# Altium schematic sheet header_conn.SchDoc
size A4; SheetNumber: 6; SheetTotal: 10
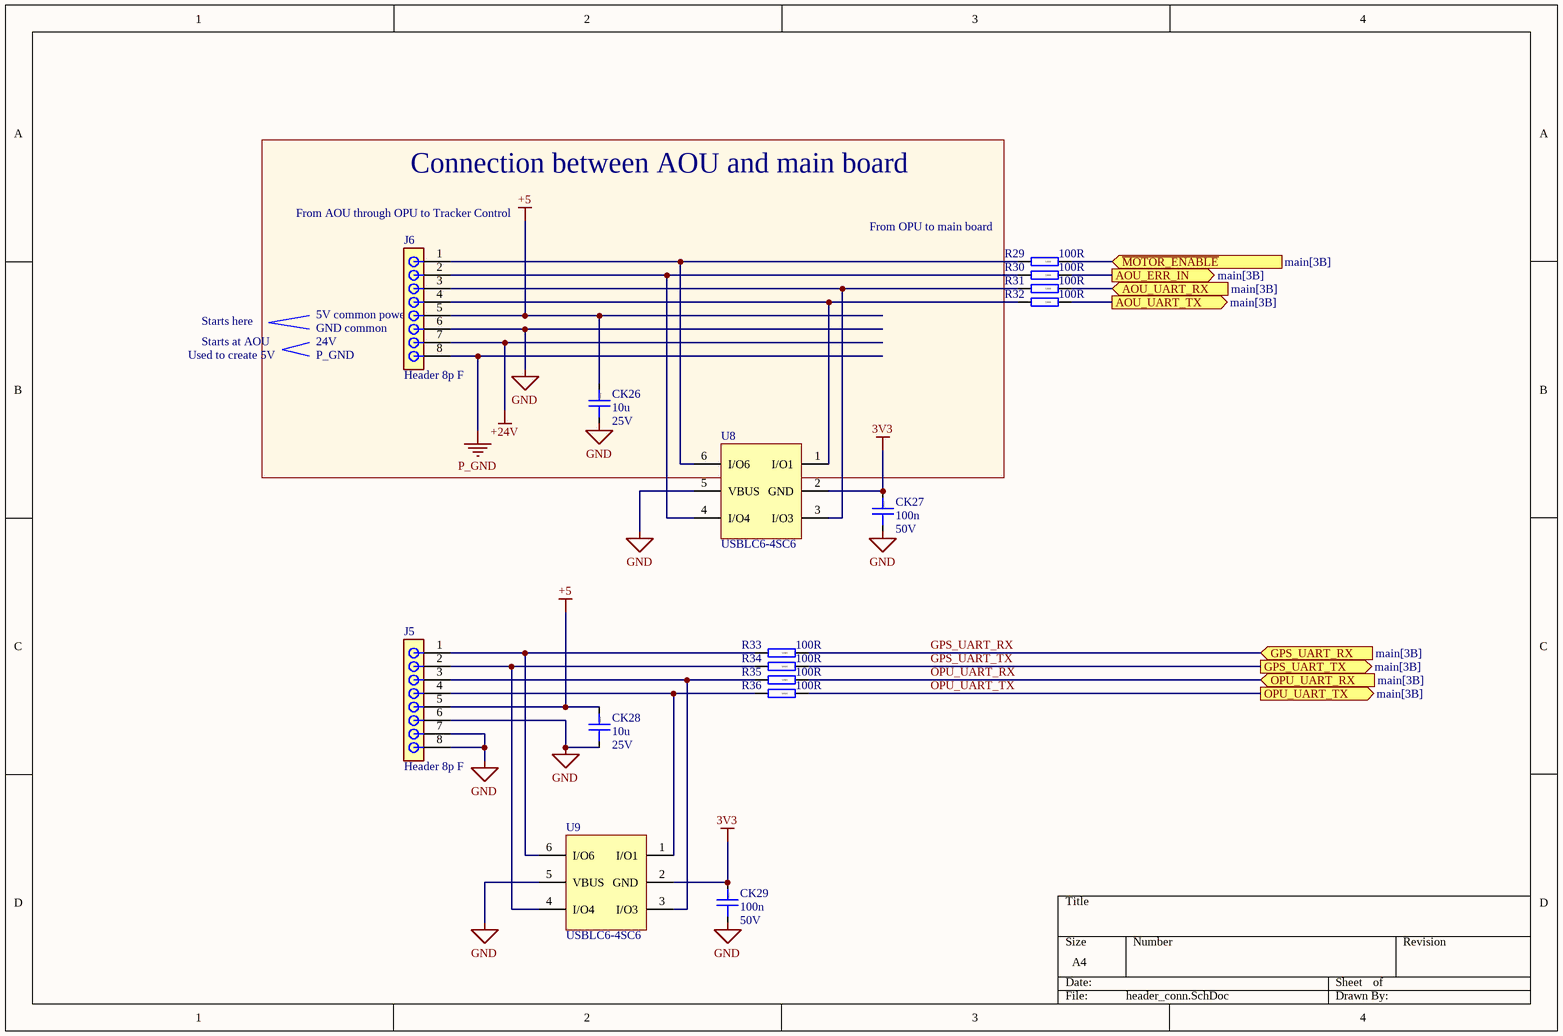
[diagram p0: header_conn.SchDoc]

## Parts
CK26  10u  Voltage rating: 25V  [CAP0805]
CK27  100n  Voltage rating: 50V  [CAP0603]
CK28  10u  Voltage rating: 25V  [CAP0805]
CK29  100n  Voltage rating: 50V  [CAP0603]
J5  Header 8p F  [Pin header 8p - F]
J6  Header 8p F  [Pin header 8p - F]
R29  100R  [RESC2012X06N(SMR0805)]
R30  100R  [RESC2012X06N(SMR0805)]
R31  100R  [RESC2012X06N(SMR0805)]
R32  100R  [RESC2012X06N(SMR0805)]
R33  100R  [RESC2012X06N(SMR0805)]
R34  100R  [RESC2012X06N(SMR0805)]
R35  100R  [RESC2012X06N(SMR0805)]
R36  100R  [RESC2012X06N(SMR0805)]
U8  USBLC6-4SC6  [SOT23-6]
U9  USBLC6-4SC6  [SOT23-6]

## Blocks framed on the sheet
Connection between AOU and main board: CK26 J6

## Ports
AOU_ERR_IN (out, see main[3B]), AOU_UART_RX (in, see main[3B]), AOU_UART_TX (out, see main[3B]), GPS_UART_RX (in, see main[3B]), GPS_UART_TX (out, see main[3B]), OPU_UART_RX (in, see main[3B]), OPU_UART_TX (out, see main[3B]), ~{MOTOR_ENABLE} (in, see main[3B])

## Nets
3V3: CK27.1 CK29.1 U8.2(GND) U9.2(GND)
+5: CK26.1 CK28.1 J5.5 J6.5
+24V: J6.7
GND: CK26.2 CK27.2 CK28.2 CK29.2 J5.6 J5.7 J5.8 J6.6 U8.5(VBUS) U9.5(VBUS)
P_GND: J6.8
~{MOTOR_ENABLE}: R29.2 ; port ~{MOTOR_ENABLE}
AOU_ERR_IN: R30.2 ; port AOU_ERR_IN
AOU_UART_RX: R31.2 ; port AOU_UART_RX
AOU_UART_TX: R32.2 ; port AOU_UART_TX
GPS_UART_RX: R33.2 ; port GPS_UART_RX
GPS_UART_TX: R34.2 ; port GPS_UART_TX
OPU_UART_RX: R35.2 ; port OPU_UART_RX
OPU_UART_TX: R36.2 ; port OPU_UART_TX
NetJ5_1: J5.1 R33.1 U9.6(I/O6)
NetJ5_2: J5.2 R34.1 U9.4(I/O4)
NetJ5_3: J5.3 R35.1 U9.3(I/O3)
NetJ5_4: J5.4 R36.1 U9.1(I/O1)
NetJ6_1: J6.1 R29.1 U8.6(I/O6)
NetJ6_2: J6.2 R30.1 U8.4(I/O4)
NetJ6_3: J6.3 R31.1 U8.3(I/O3)
NetJ6_4: J6.4 R32.1 U8.1(I/O1)

## Notes on the sheet
- (near J6) From AOU through OPU to Tracker Control
- From OPU to main board
- Used to create 5V
- Starts at AOU
- Starts here
- (near J6) 5V common power
- (near J6) GND common
- 24V
- P_GND
- (in symbol Cap 10u 0805) 0805
- (in symbol Cap 100n 0603) 0603

## Library data of the parts
CK26 CK28 = Cap 10u 0805: 25V 10uF X5R ±10% 0805 Multilayer Ceramic Capacitors MLCC - SMD/SMT ROHS; Basic: Yes; JLCPCB Part: C15850; Value: 10u
CK27 CK29 = Cap 100n 0603: 50V 100nF X7R ±10% 0603 Multilayer Ceramic Capacitors MLCC - SMD/SMT ROHS; Basic: Yes; Value: 100n; JLCPCB Part: C14663
J5 J6 = Pin header 8p_F: 3A Direct Insert Policy 6P -40℃~+105℃ 2.54mm Single Row Black Brass 1x6P Plugin,P=2.54mm Pin Headers ROHS; Manufacturer_Name: Connfly; Manufacturer_Part_Number: DS1021-1*2SF11-B; Datasheet Link: https://www.tme.com/Document/cc301e58a5da78cb543a94b5a5b7f06a/DS1021.pdf; Height: 5.88mm
R29-R36 = Res 100R 0805: 125mW Thick Film Resistors 150V ±100ppm/℃ ±1% 100Ω 0805 Chip Resistor - Surface Mount ROHS; Tolerance & Rating: 1%/0.1W; Basic: Yes; Value: 100R; Package: 0805; Author: JP/27.03.2014; SMD: 1; ComponentLink3Description: rezistor čip; ComponentLink3URL: heliosgreen://v1/hegMT/5-MT/Classes(343)/Folders/OpenForm?RecordNumbers=[381513]; JLCPCB Part: C17408
U8 U9 = USBLC6-4SC6: 5A 17V 6V Unidirectional 5.25V SOT-23-6 ESD and Surge Protection (TVS/ESD) ROHS; Basic: No; JLCPCB Part: C111212; TME Part: USBLC6-4SC6